# Altium schematic sheet Actuators.SchDoc
size 250 x 176 mm; Date: 17.10.2024r.; Author: Bartłomiej Smoter; Revision: v1; SheetNumber: 6; SheetTotal: 6
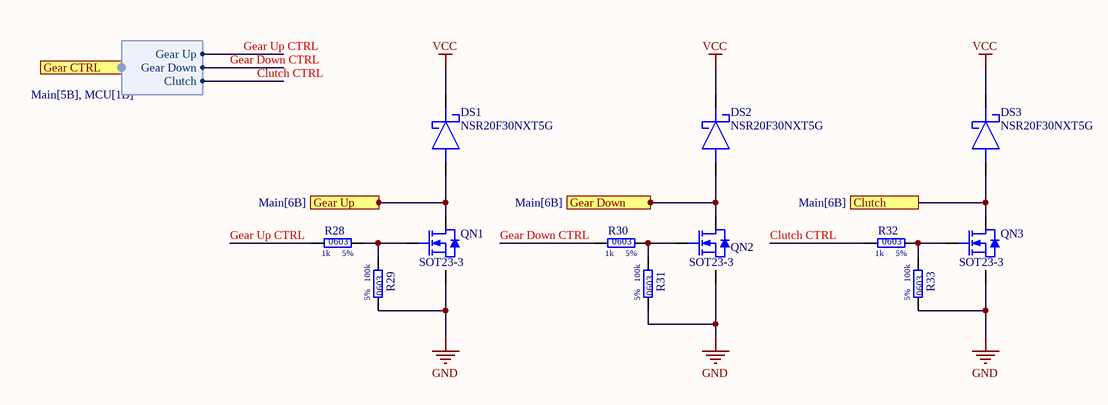
[diagram p0: Actuators.SchDoc]

## Parts
DS1  Man. Part Num.: NSR20F30NXT5G  [0603]  (hidden comment: DS_NSR20F30NXT5G)
DS2  Man. Part Num.: NSR20F30NXT5G  [0603]  (hidden comment: DS_NSR20F30NXT5G)
DS3  Man. Part Num.: NSR20F30NXT5G  [0603]  (hidden comment: DS_NSR20F30NXT5G)
QN1  Case/Package: SOT23-3  [SOT23]  (hidden comment: QN_IRLML6344TRPBF)
QN2  Case/Package: SOT23-3  [SOT23]  (hidden comment: QN_IRLML6344TRPBF)
QN3  Case/Package: SOT23-3  [SOT23]  (hidden comment: QN_IRLML6344TRPBF)
R28  Tolerance: 5%  Resistance: 1k  Case/Package: 0603  [0603_HandSold_Resistor]  (hidden comment: R_1k_0603_5)
R29  Tolerance: 5%  Resistance: 100k  Case/Package: 0603  [0603_HandSold_Resistor]  (hidden comment: R_100k_0603_5)
R30  Tolerance: 5%  Resistance: 1k  Case/Package: 0603  [0603_HandSold_Resistor]  (hidden comment: R_1k_0603_5)
R31  Tolerance: 5%  Resistance: 100k  Case/Package: 0603  [0603_HandSold_Resistor]  (hidden comment: R_100k_0603_5)
R32  Tolerance: 5%  Resistance: 1k  Case/Package: 0603  [0603_HandSold_Resistor]  (hidden comment: R_1k_0603_5)
R33  Tolerance: 5%  Resistance: 100k  Case/Package: 0603  [0603_HandSold_Resistor]  (hidden comment: R_100k_0603_5)

## Ports
Clutch (see Main[6B]), Gear CTRL (harness Gears, see Main[5B], MCU[1B]), Gear Down (see Main[6B]), Gear Up (see Main[6B])

## Harnesses
Gears: Gear Up, Gear Down, Clutch

## Nets
GND: QN1.3(S) QN2.3(S) QN3.3(S) R29.2 R31.2 R33.2
VCC: DS1.1(K) DS2.1(K) DS3.1(K)
Clutch: DS3.2(A) QN3.2(D) ; port Clutch
Clutch CTRL: R32.1 ; port Gear CTRL.Clutch
Gear Down: DS2.2(A) QN2.2(D) ; port Gear Down
Gear Down CTRL: R30.1 ; port Gear CTRL.Gear Down
Gear Up: DS1.2(A) QN1.2(D) ; port Gear Up
Gear Up CTRL: R28.1 ; port Gear CTRL.Gear Up
NetQN1_1: QN1.1(G) R28.2 R29.1
NetQN2_1: QN2.1(G) R30.2 R31.1
NetQN3_1: QN3.1(G) R32.2 R33.1

## Notes on the sheet
- Name:
- Author:
- Project:
- Revision:
- Date:

## Library data of the parts
DS1-DS3 = CMP-004-00030-1: Schottky, 480mV 2A 1.75W 0603; Revision Num.: 1; Reverse Voltage: 30V; Max. Forward Voltage: 480mV; Power: 1.75W; Mounting Technology: SMT; Type of Diode: Schottky; Case/Package: 0603; Max. Forward Current: 2A; HelpURL: https://www.mouser.pl/datasheet/2/308/1/NSR20F30_D-2318285.pdf
QN1-QN3 = CMP-002-000010-11: Trans MOSFET N-CH 30V 5A 3-Pin SOT-23 T/R; pin to pad: 2>3 3>2; Vgs / Vbe: 12V; Revision Num.: Revision #1; Rds / Rce: 29m; Power: 1.3W; Man. Part Num.: IRLML6344TRPBF; Id / Ic: 5A; Mounting Technology: SMT; Vds / Vce: 30V; HelpURL: https://www.mouser.pl/datasheet/2/196/Infineon_IRLML6344_DataSheet_v01_01_EN-3166606.pdf; Transistor Type: NMOS
R28 R30 R32 = CMP-009-00001-19: Revision Num.: 1; Voltage Rating: 75V; Power: 100mW; HelpURL: https://eu.mouser.com/datasheet/2/447/YAGEO_PYu_RC_Group_51_RoHS_L_12-3313492.pdf; Mounting Technology: SMT
R29 R31 R33 = CMP-009-00012-11: Revision Num.: 1; Voltage Rating: 50V; Power: 100mW; HelpURL: https://www.tme.eu/Document/fd8030aace7fa4ecbd326eab752e0f92/CQ%20datasheet.pdf; Mounting Technology: SMT